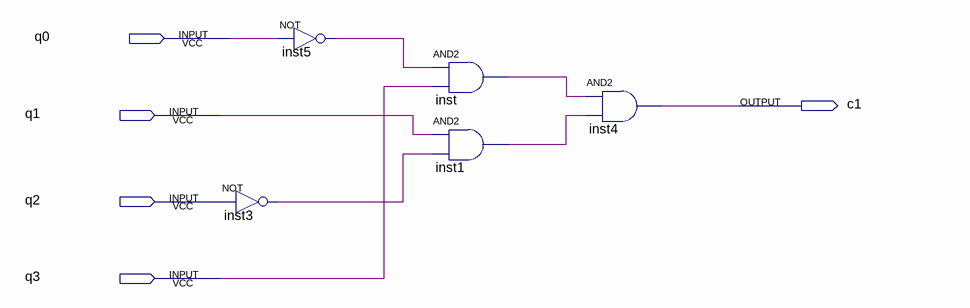
[diagram p0: schematic sheet]
// Quartus schematic controlador.bdf as structural Verilog: 5 symbols, 5 pins
module controlador (
  input  q0,
  input  q1,
  input  q2,
  input  q3,
  output c1
);

  wire inst1_out, inst3_out, inst5_out, inst_out;

  not inst3 (inst3_out, q2);
  not inst5 (inst5_out, q0);
  and inst (inst_out, inst5_out, q3);
  and inst1 (inst1_out, q1, inst3_out);
  and inst4 (c1, inst_out, inst1_out);
endmodule
